# EasyEDA schematic SCH_wiring_diagram_2026-05-13.json
TITLE: Wiring Diagram - Receiver; REV: 1.0; Date: 2026-05-13; Sheet: 1/1; Drawn By: CES
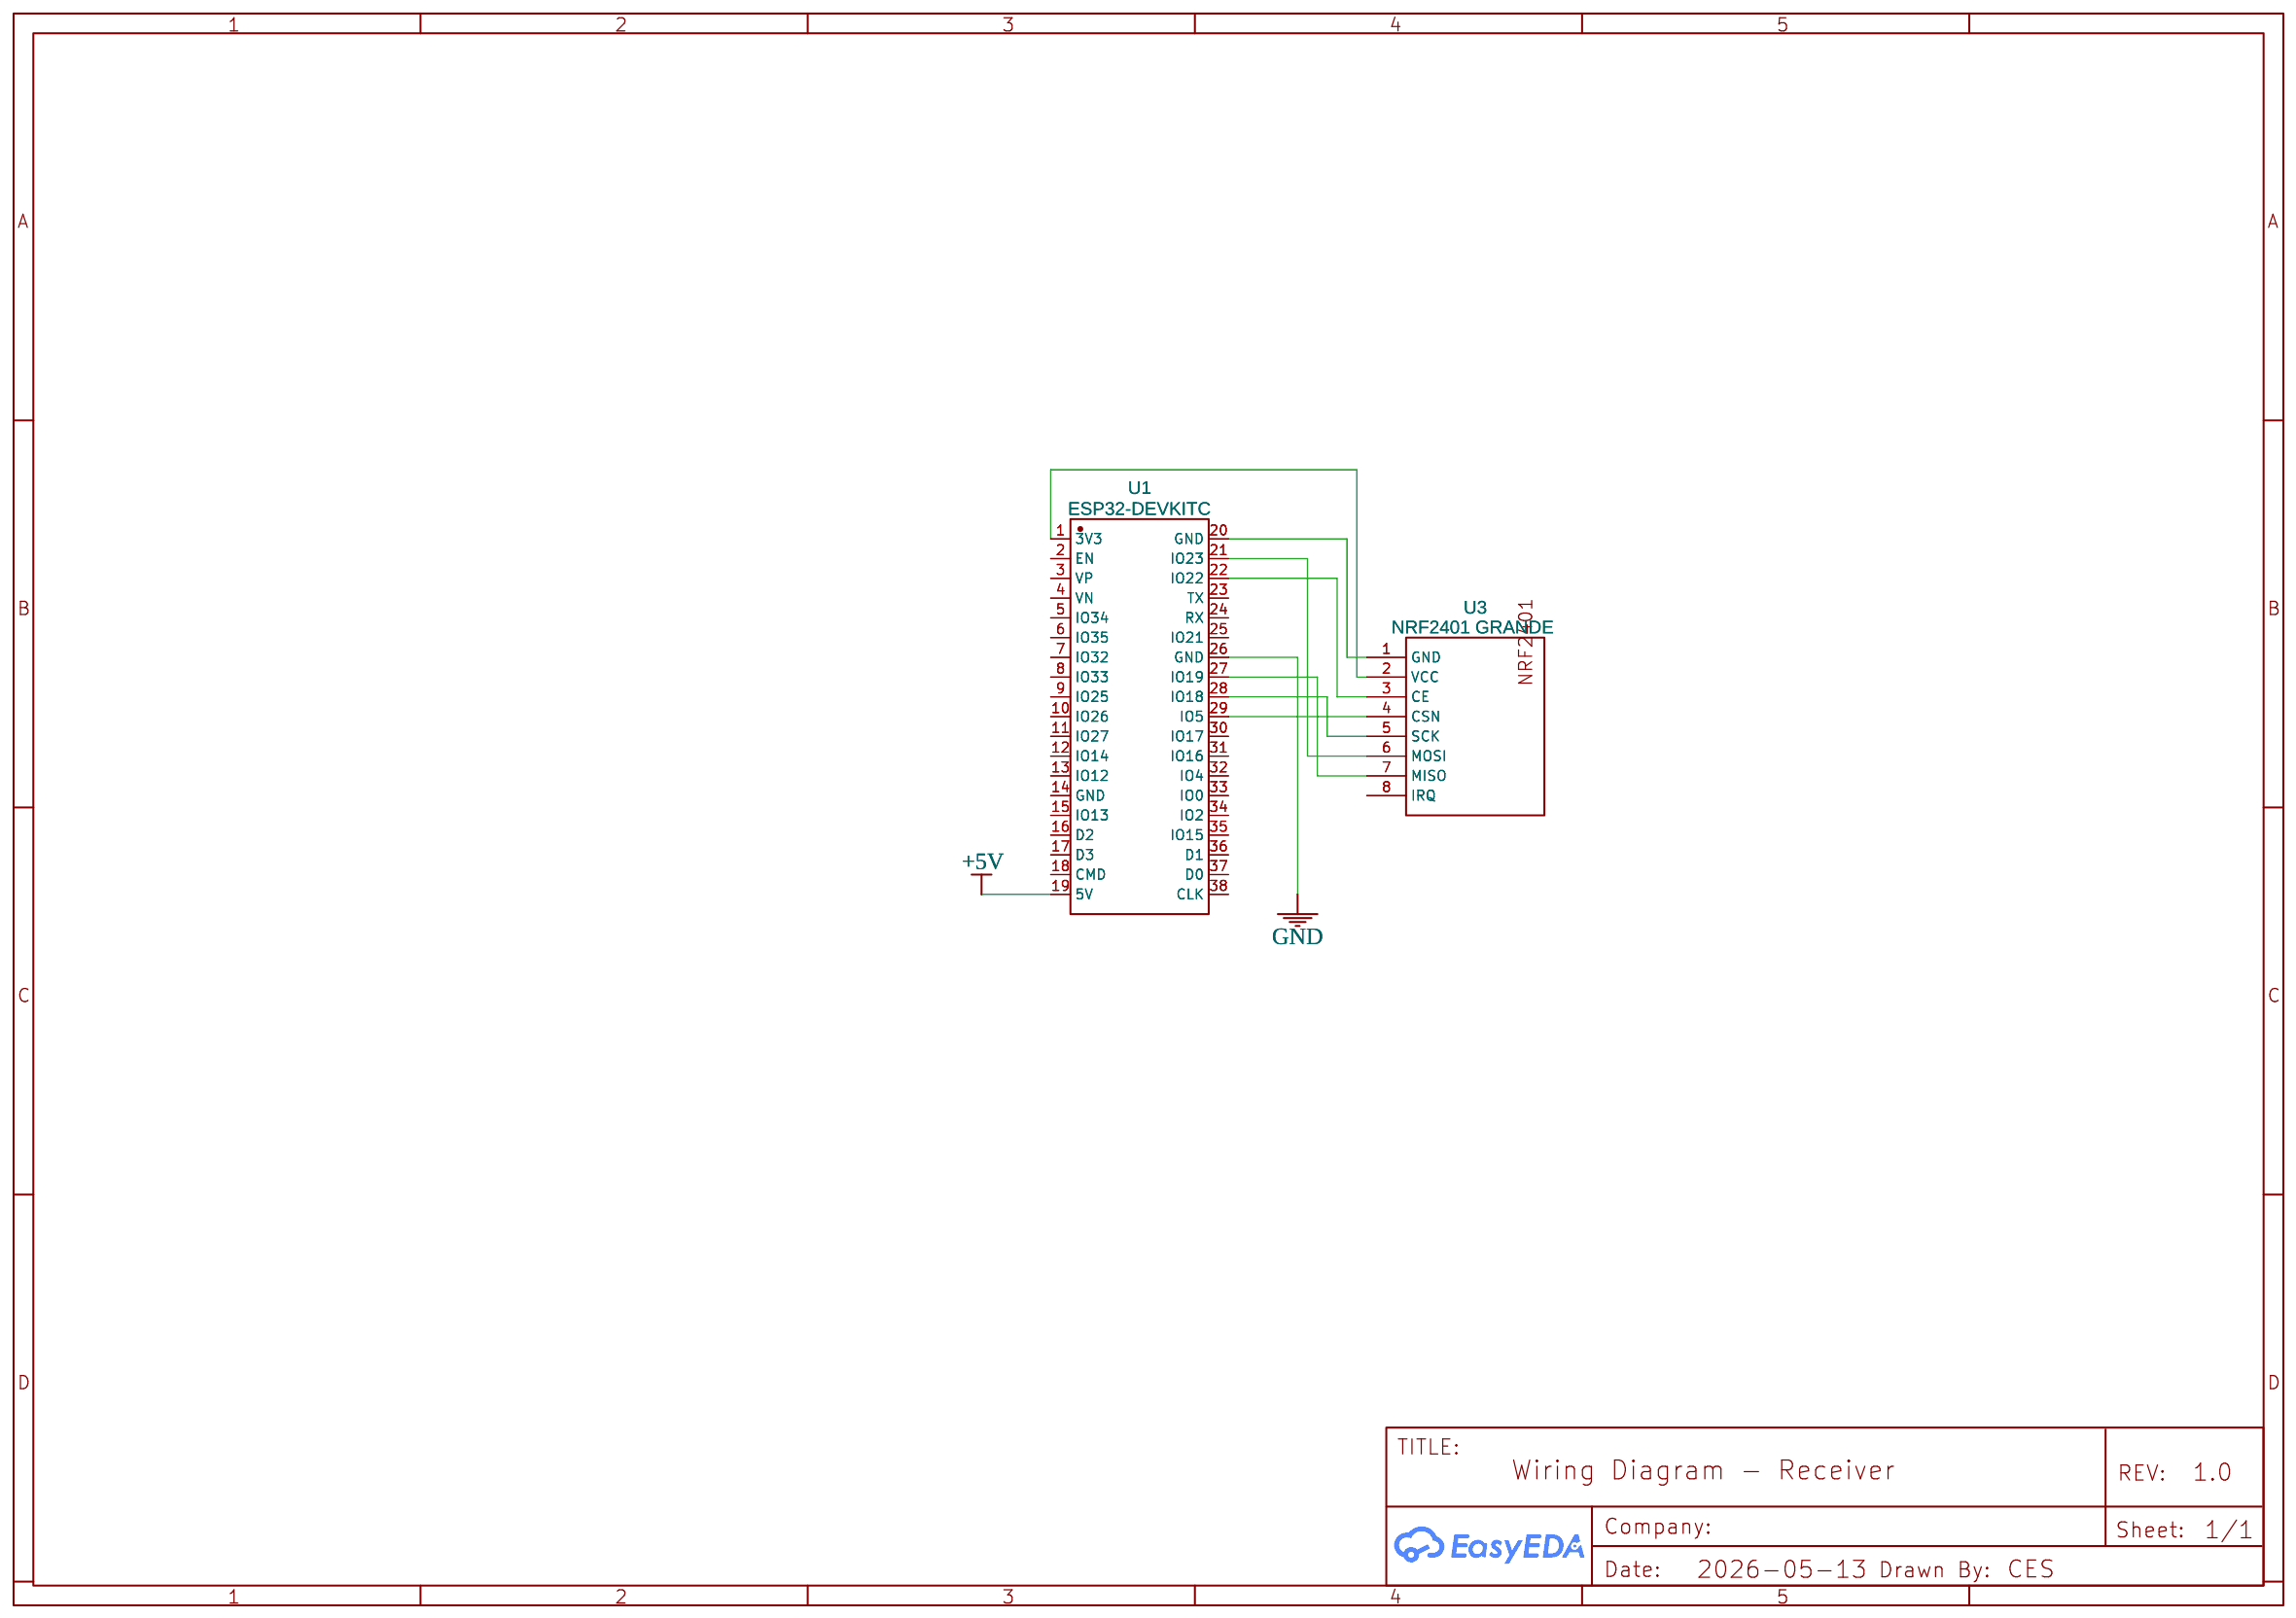
[diagram p0: schematic sheet]

## Parts
U1  ESP32-DEVKITC  [BULETM-SMD_ESP32-DEVKITC]
U3  NRF2401 GRANDE  [NRF2401+PA+LNA]

## Library data of the parts
U1 = ESP32-DEVKITC: Supplier: LCSC; Supplier Part: C571180; Manufacturer: ESPRESSIF(乐鑫); Manufacturer Part: ESP32-DevKitC; Contributor: lcsc
U3 = NRF2401_GRANDE: Contributor: jgrogers

## Nets
+5V: U1.19(5V)
GND: U1.26(GND)
Net-(U1-1): U1.1(3V3) U3.2(VCC)
Net-(U1-20): U1.20(GND) U3.1(GND)
Net-(U1-21): U1.21(IO23) U3.6(MOSI)
Net-(U1-22): U1.22(IO22) U3.3(CE)
Net-(U1-27): U1.27(IO19) U3.7(MISO)
Net-(U1-28): U1.28(IO18) U3.5(SCK)
Net-(U1-29): U1.29(IO5) U3.4(CSN)

Not connected (* = marked no-connect by the designer): U1 2(EN) 3(VP) 4(VN) 5(IO34) 6(IO35) 7(IO32) 8(IO33) 9(IO25) 10(IO26) 11(IO27) 12(IO14) 13(IO12) 14(GND) 15(IO13) 16(D2) 17(D3) 18(CMD) 23(TX) 24(RX) 25(IO21) 30(IO17) 31(IO16) 32(IO4) 33(IO0) 34(IO2) 35(IO15) 36(D1) 37(D0) 38(CLK); U3 8(IRQ)
